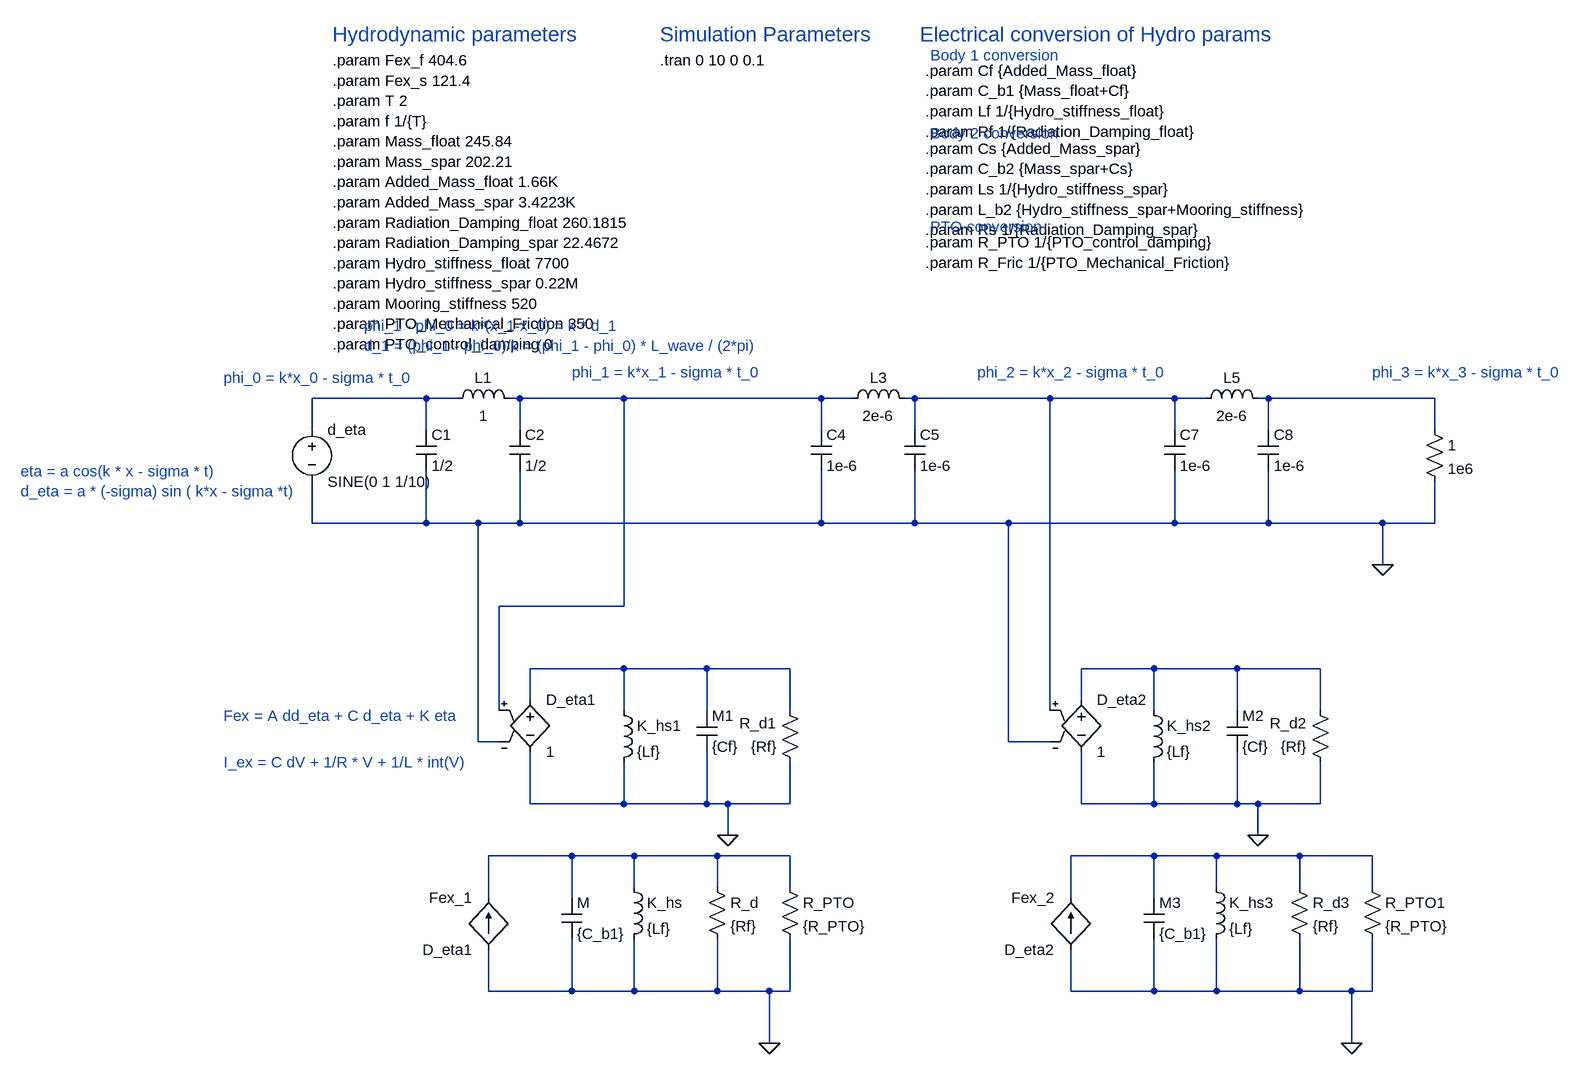
[diagram p0: schematic Array_WECs.asc]
Array_WECs.asc, the LTspice schematic file:
Version 4
SHEET 1 1188 816
WIRE -576 -272 -752 -272
WIRE -528 -272 -576 -272
WIRE -432 -272 -448 -272
WIRE -272 -272 -432 -272
WIRE 32 -272 -272 -272
WIRE 80 -272 32 -272
WIRE 176 -272 160 -272
WIRE 384 -272 176 -272
WIRE 576 -272 384 -272
WIRE 624 -272 576 -272
WIRE 720 -272 704 -272
WIRE 976 -272 720 -272
WIRE -752 -224 -752 -272
WIRE -576 -224 -576 -272
WIRE -432 -224 -432 -272
WIRE 32 -224 32 -272
WIRE 176 -224 176 -272
WIRE 576 -224 576 -272
WIRE 720 -224 720 -272
WIRE 976 -224 976 -272
WIRE -752 -80 -752 -144
WIRE -576 -80 -576 -160
WIRE -576 -80 -752 -80
WIRE -496 -80 -576 -80
WIRE -432 -80 -432 -160
WIRE -432 -80 -496 -80
WIRE 32 -80 32 -160
WIRE 32 -80 -432 -80
WIRE 176 -80 176 -160
WIRE 176 -80 32 -80
WIRE 320 -80 176 -80
WIRE 576 -80 576 -160
WIRE 576 -80 320 -80
WIRE 720 -80 720 -160
WIRE 720 -80 576 -80
WIRE 896 -80 720 -80
WIRE 976 -80 976 -144
WIRE 976 -80 896 -80
WIRE 896 -16 896 -80
WIRE -272 48 -272 -272
WIRE -272 48 -464 48
WIRE -272 144 -416 144
WIRE -144 144 -272 144
WIRE -16 144 -144 144
WIRE 544 144 432 144
WIRE 672 144 544 144
WIRE 800 144 672 144
WIRE -416 192 -416 144
WIRE 432 192 432 144
WIRE -464 208 -464 48
WIRE -272 208 -272 144
WIRE -144 208 -144 144
WIRE -16 208 -16 144
WIRE 384 208 384 -272
WIRE 544 208 544 144
WIRE 672 208 672 144
WIRE 800 208 800 144
WIRE -496 256 -496 -80
WIRE -464 256 -496 256
WIRE 320 256 320 -80
WIRE 384 256 320 256
WIRE -416 352 -416 272
WIRE -272 352 -272 288
WIRE -272 352 -416 352
WIRE -144 352 -144 272
WIRE -144 352 -272 352
WIRE -112 352 -144 352
WIRE -16 352 -16 288
WIRE -16 352 -112 352
WIRE 432 352 432 272
WIRE 544 352 544 288
WIRE 544 352 432 352
WIRE 672 352 672 272
WIRE 672 352 544 352
WIRE 704 352 672 352
WIRE 800 352 800 288
WIRE 800 352 704 352
WIRE -112 400 -112 352
WIRE 704 400 704 352
WIRE -352 432 -480 432
WIRE -256 432 -352 432
WIRE -128 432 -256 432
WIRE -16 432 -128 432
WIRE 544 432 416 432
WIRE 640 432 544 432
WIRE 768 432 640 432
WIRE 880 432 768 432
WIRE -256 480 -256 432
WIRE -128 480 -128 432
WIRE -16 480 -16 432
WIRE 640 480 640 432
WIRE 768 480 768 432
WIRE 880 480 880 432
WIRE -480 496 -480 432
WIRE -352 496 -352 432
WIRE 416 496 416 432
WIRE 544 496 544 432
WIRE -480 640 -480 576
WIRE -352 640 -352 560
WIRE -352 640 -480 640
WIRE -256 640 -256 560
WIRE -256 640 -352 640
WIRE -128 640 -128 560
WIRE -128 640 -256 640
WIRE -48 640 -128 640
WIRE -16 640 -16 560
WIRE -16 640 -48 640
WIRE 416 640 416 576
WIRE 544 640 544 560
WIRE 544 640 416 640
WIRE 640 640 640 560
WIRE 640 640 544 640
WIRE 768 640 768 560
WIRE 768 640 640 640
WIRE 848 640 768 640
WIRE 880 640 880 560
WIRE 880 640 848 640
WIRE -48 720 -48 640
WIRE 848 720 848 640
FLAG 896 -16 0
FLAG -48 720 0
FLAG -112 400 0
FLAG 848 720 0
FLAG 704 400 0
SYMBOL voltage -752 -240 R0
SYMATTR InstName d_eta
SYMATTR Value SINE(0 1 1/10)
SYMBOL cap -592 -224 R0
SYMATTR InstName C1
SYMATTR Value 1/2
SYMBOL cap -448 -224 R0
SYMATTR InstName C2
SYMATTR Value 1/2
SYMBOL ind -544 -256 R270
WINDOW 0 32 56 VTop 2
WINDOW 3 5 56 VBottom 2
SYMATTR InstName L1
SYMATTR Value 1
SYMBOL cap -368 496 R0
SYMATTR InstName M
SYMATTR Value {C_b1}
SYMBOL ind -272 464 R0
SYMATTR InstName K_hs
SYMATTR Value {Lf}
SYMBOL res -144 464 R0
SYMATTR InstName R_d
SYMATTR Value {Rf}
SYMBOL res -32 464 R0
SYMATTR InstName R_PTO
SYMATTR Value {R_PTO}
SYMBOL cap 16 -224 R0
SYMATTR InstName C4
SYMATTR Value 1e-6
SYMBOL cap 160 -224 R0
SYMATTR InstName C5
SYMATTR Value 1e-6
SYMBOL ind 64 -256 R270
WINDOW 0 32 56 VTop 2
WINDOW 3 5 56 VBottom 2
SYMATTR InstName L3
SYMATTR Value 2e-6
SYMBOL cap 560 -224 R0
SYMATTR InstName C7
SYMATTR Value 1e-6
SYMBOL cap 704 -224 R0
SYMATTR InstName C8
SYMATTR Value 1e-6
SYMBOL ind 608 -256 R270
WINDOW 0 32 56 VTop 2
WINDOW 3 5 56 VBottom 2
SYMATTR InstName L5
SYMATTR Value 2e-6
SYMBOL res 960 -240 R0
SYMATTR InstName 1
SYMATTR Value 1e6
SYMBOL cap -160 208 R0
SYMATTR InstName M1
SYMATTR Value {Cf}
SYMBOL ind -288 192 R0
SYMATTR InstName K_hs1
SYMATTR Value {Lf}
SYMBOL res 0 304 R180
WINDOW 0 36 76 Left 2
WINDOW 3 36 40 Left 2
SYMATTR InstName R_d1
SYMATTR Value {Rf}
SYMBOL e -416 176 R0
SYMATTR InstName D_eta1
SYMATTR Value 1
SYMBOL f -480 576 R180
WINDOW 0 24 80 Left 2
WINDOW 3 24 0 Left 2
SYMATTR InstName Fex_1
SYMATTR Value D_eta1
SYMATTR Value2 1
SYMBOL e 432 176 R0
SYMATTR InstName D_eta2
SYMATTR Value 1
SYMBOL cap 528 496 R0
SYMATTR InstName M3
SYMATTR Value {C_b1}
SYMBOL ind 624 464 R0
SYMATTR InstName K_hs3
SYMATTR Value {Lf}
SYMBOL res 752 464 R0
SYMATTR InstName R_d3
SYMATTR Value {Rf}
SYMBOL res 864 464 R0
SYMATTR InstName R_PTO1
SYMATTR Value {R_PTO}
SYMBOL f 416 576 R180
WINDOW 0 24 80 Left 2
WINDOW 3 24 0 Left 2
SYMATTR InstName Fex_2
SYMATTR Value D_eta2
SYMATTR Value2 1
SYMBOL cap 656 208 R0
SYMATTR InstName M2
SYMATTR Value {Cf}
SYMBOL ind 528 192 R0
SYMATTR InstName K_hs2
SYMATTR Value {Lf}
SYMBOL res 816 304 R180
WINDOW 0 36 76 Left 2
WINDOW 3 36 40 Left 2
SYMATTR InstName R_d2
SYMATTR Value {Rf}
TEXT 192 -776 Left 2 !.param Cf {Added_Mass_float}\n.param C_b1 {Mass_float+Cf}\n.param Lf 1/{Hydro_stiffness_float}\n.param Rf 1/{Radiation_Damping_float}
TEXT -720 -792 Left 2 !.param Fex_f 404.6\n.param Fex_s 121.4\n.param T 2\n.param f 1/{T}\n.param Mass_float 245.84\n.param Mass_spar 202.21\n.param Added_Mass_float 1.66K\n.param Added_Mass_spar 3.4223K\n.param Radiation_Damping_float 260.1815 \n.param Radiation_Damping_spar 22.4672\n.param Hydro_stiffness_float 7700\n.param Hydro_stiffness_spar 0.22M\n.param Mooring_stiffness 520\n.param PTO_Mechanical_Friction 350\n.param PTO_control_damping 0
TEXT -888 216 Left 2 ;Fex = A dd_eta + C d_eta + K eta
TEXT -1200 -160 Left 2 ;eta = a cos(k * x - sigma * t)\nd_eta = a * (-sigma) sin ( k*x - sigma *t)
TEXT -888 -304 Left 2 ;phi_0 = k*x_0 - sigma * t_0
TEXT -352 -312 Left 2 ;phi_1 = k*x_1 - sigma * t_0
TEXT 272 -312 Left 2 ;phi_2 = k*x_2 - sigma * t_0
TEXT 880 -312 Left 2 ;phi_3 = k*x_3 - sigma * t_0
TEXT -672 -384 Left 2 ;phi_1 - phi_0 = k*(x_1-x_0) = k * d_1\nd_1 = (phi_1 - phi_0)/k = (phi_1 - phi_0) * L_wave / (2*pi)
TEXT -888 288 Left 2 ;I_ex = C dV + 1/R * V + 1/L * int(V)
TEXT -216 -792 Left 2 !.tran 0 10 0 0.1
TEXT -216 -832 Left 3 ;Simulation Parameters
TEXT -720 -832 Left 3 ;Hydrodynamic parameters
TEXT 184 -832 Left 3 ;Electrical conversion of Hydro params
TEXT 192 -656 Left 2 !.param Cs {Added_Mass_spar}\n.param C_b2 {Mass_spar+Cs}\n.param Ls 1/{Hydro_stiffness_spar}\n.param L_b2 {Hydro_stiffness_spar+Mooring_stiffness}\n.param Rs 1/{Radiation_Damping_spar}
TEXT 192 -512 Left 2 !.param R_PTO 1/{PTO_control_damping}\n.param R_Fric 1/{PTO_Mechanical_Friction}
TEXT 200 -800 Left 2 ;Body 1 conversion
TEXT 200 -680 Left 2 ;Body 2 conversion
TEXT 200 -536 Left 2 ;PTO conversion

The netlist it stands for:
* Array_WECs.asc
V§d_eta N001 0 SINE(0 1 1/10)
C1 N001 0 1/2
C2 N002 0 1/2
L1 N001 N002 1
C§M N007 0 {C_b1}
L§K_hs N007 0 {Lf}
R_d N007 0 {Rf}
R_PTO N007 0 {R_PTO}
C4 N002 0 1e-6
C5 N003 0 1e-6
L3 N002 N003 2e-6
C7 N003 0 1e-6
C8 N004 0 1e-6
L5 N003 N004 2e-6
R§1 N004 0 1e6
C§M1 N005 0 {Cf}
L§K_hs1 N005 0 {Lf}
R_d1 0 N005 {Rf}
E§D_eta1 N005 0 N002 0 1
Fex_1 0 N007 D_eta1 1
E§D_eta2 N006 0 N003 0 1
C§M3 N008 0 {C_b1}
L§K_hs3 N008 0 {Lf}
R_d3 N008 0 {Rf}
R_PTO1 N008 0 {R_PTO}
Fex_2 0 N008 D_eta2 1
C§M2 N006 0 {Cf}
L§K_hs2 N006 0 {Lf}
R_d2 0 N006 {Rf}
.param Cf {Added_Mass_float}
.param C_b1 {Mass_float+Cf}
.param Lf 1/{Hydro_stiffness_float}
.param Rf 1/{Radiation_Damping_float}
.param Fex_f 404.6
.param Fex_s 121.4
.param T 2
.param f 1/{T}
.param Mass_float 245.84
.param Mass_spar 202.21
.param Added_Mass_float 1.66K
.param Added_Mass_spar 3.4223K
.param Radiation_Damping_float 260.1815
.param Radiation_Damping_spar 22.4672
.param Hydro_stiffness_float 7700
.param Hydro_stiffness_spar 0.22M
.param Mooring_stiffness 520
.param PTO_Mechanical_Friction 350
.param PTO_control_damping 0
* Fex = A dd_eta + C d_eta + K eta
* eta = a cos(k * x - sigma * t)
* d_eta = a * (-sigma) sin ( k*x - sigma *t)
* phi_0 = k*x_0 - sigma * t_0
* phi_1 = k*x_1 - sigma * t_0
* phi_2 = k*x_2 - sigma * t_0
* phi_3 = k*x_3 - sigma * t_0
* phi_1 - phi_0 = k*(x_1-x_0) = k * d_1
* d_1 = (phi_1 - phi_0)/k = (phi_1 - phi_0) * L_wave / (2*pi)
* I_ex = C dV + 1/R * V + 1/L * int(V)
.tran 0 10 0 0.1
* Simulation Parameters
* Hydrodynamic parameters
* Electrical conversion of Hydro params
.param Cs {Added_Mass_spar}
.param C_b2 {Mass_spar+Cs}
.param Ls 1/{Hydro_stiffness_spar}
.param L_b2 {Hydro_stiffness_spar+Mooring_stiffness}
.param Rs 1/{Radiation_Damping_spar}
.param R_PTO 1/{PTO_control_damping}
.param R_Fric 1/{PTO_Mechanical_Friction}
* Body 1 conversion
* Body 2 conversion
* PTO conversion
.backanno
.end